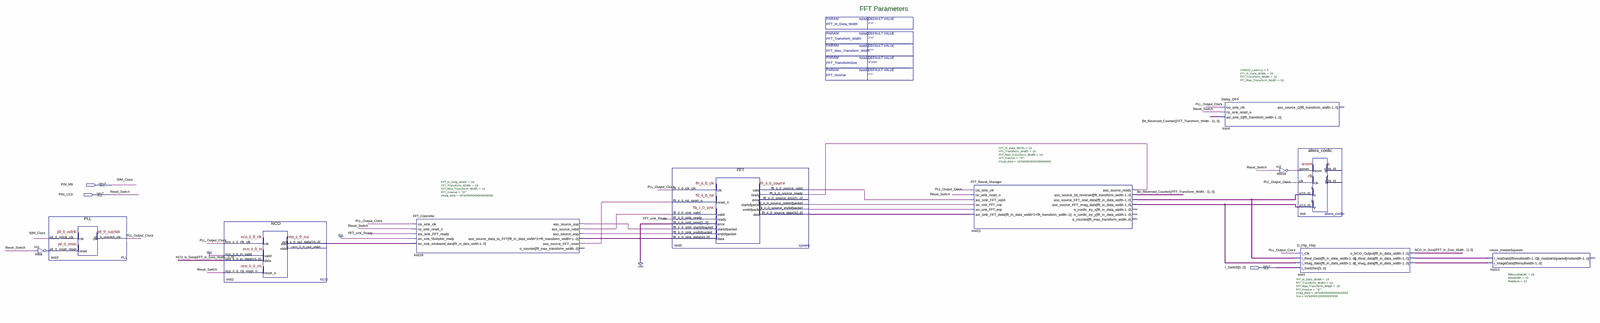
[diagram p0: schematic sheet, whole]
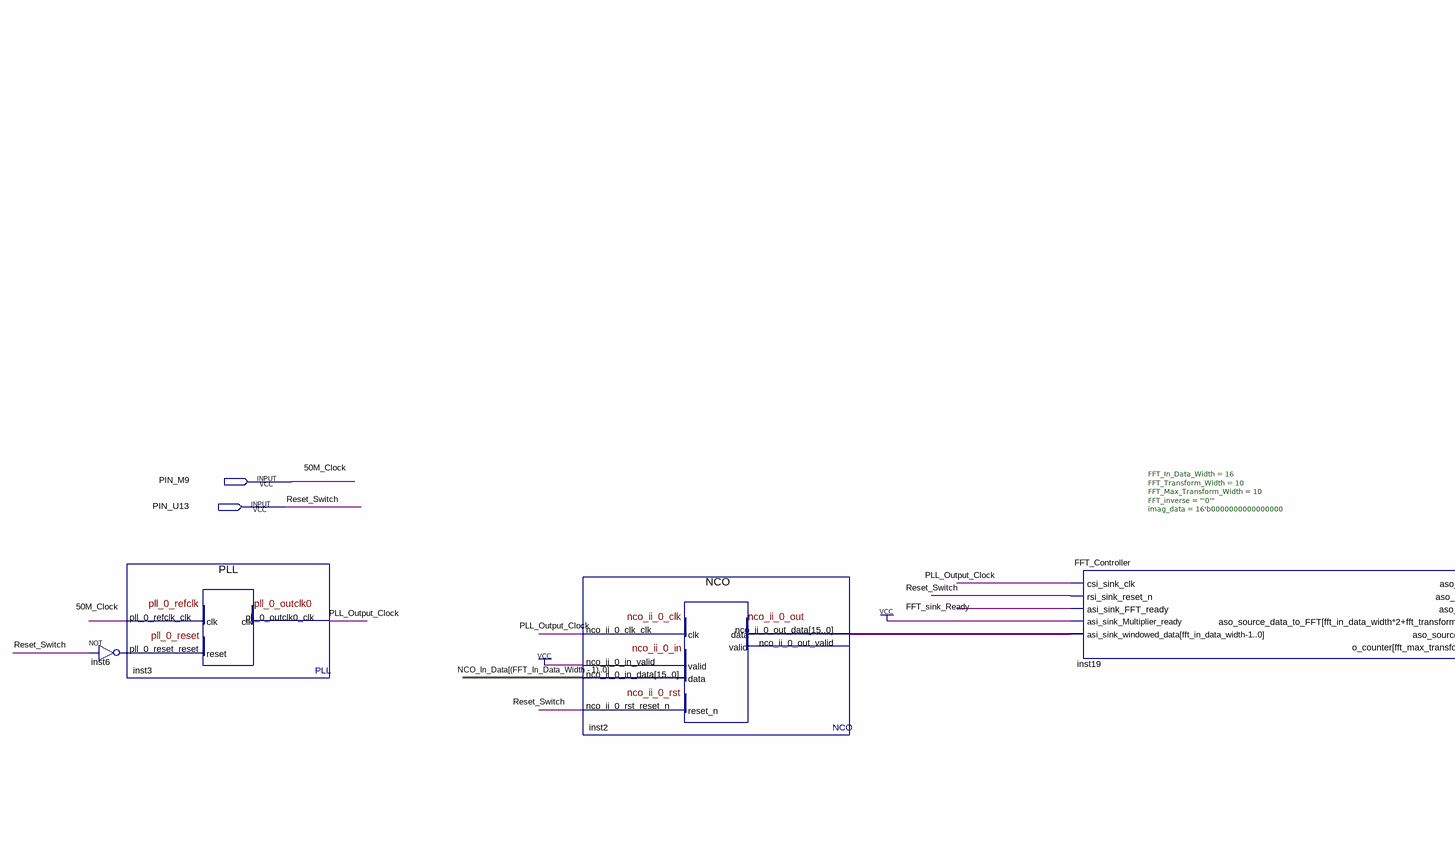
[diagram p1: schematic sheet, left part]
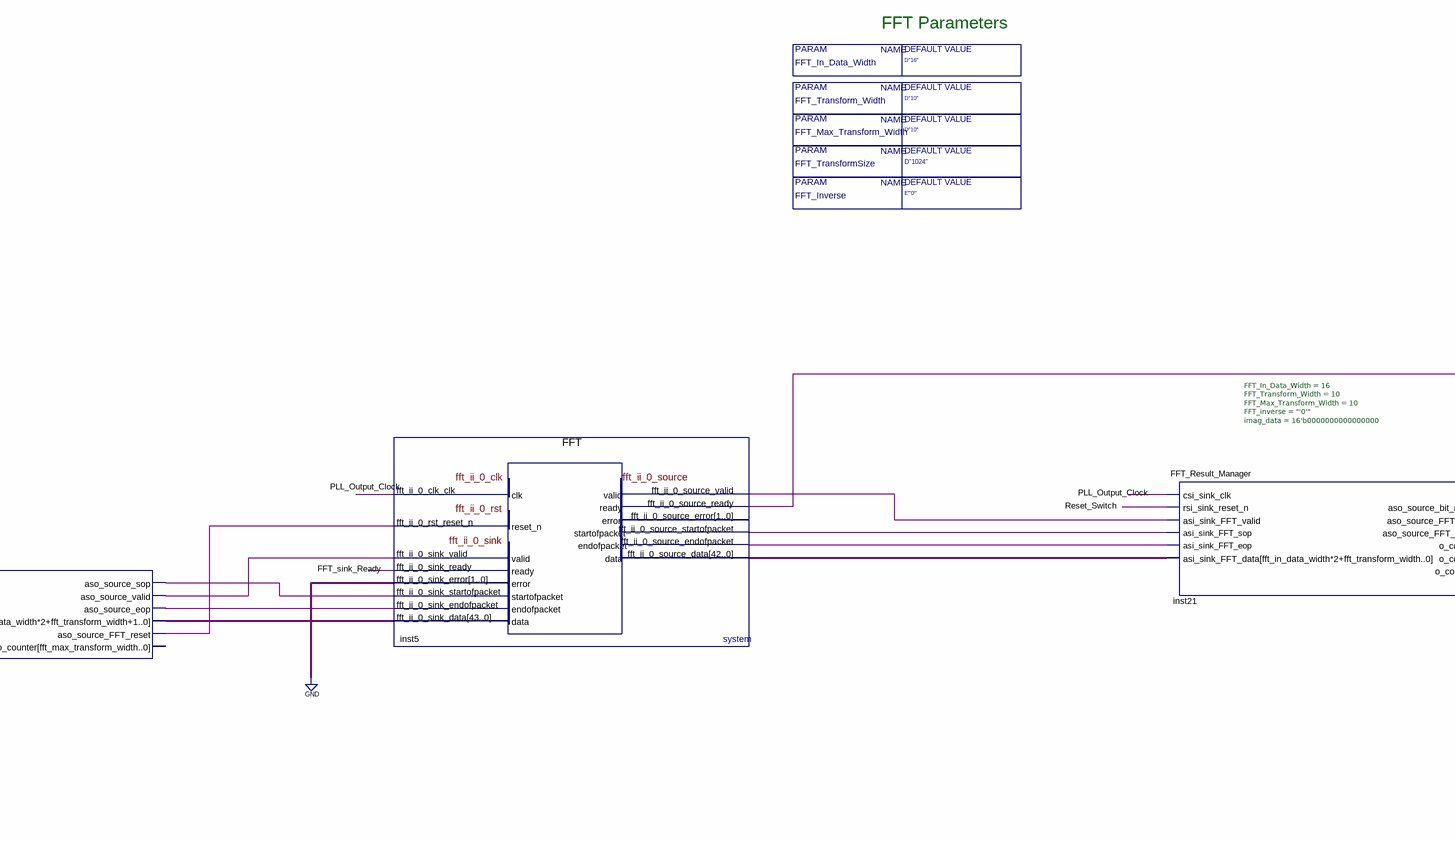
[diagram p2: schematic sheet, centre part]
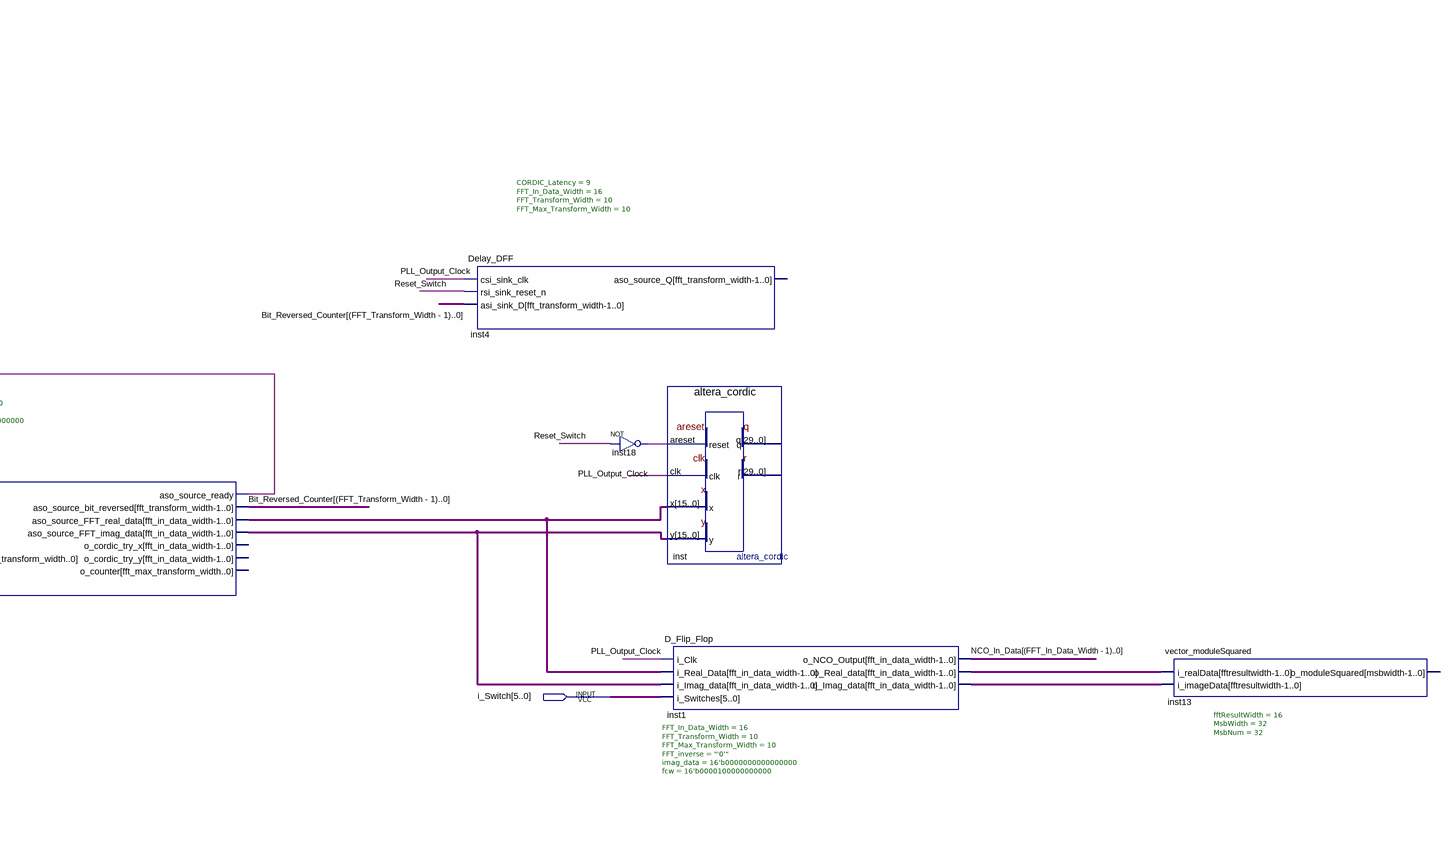
[diagram p3: schematic sheet, right part]
// Quartus schematic Top_Level_BDF.bdf as structural Verilog: 11 symbols, 3 pins
module Top_Level_BDF #(parameter FFT_Inverse = "E\"'0'\"", parameter FFT_In_Data_Width = "D\"16\"", parameter FFT_TransformSize = "D\"1024\"", parameter FFT_Transform_Width = "D\"10\"", parameter FFT_Max_Transform_Width = "D\"10\"") (
  input  PIN_M9,
  input  PIN_U13,
  input  [5:0] i_Switch
);

  wire \Bit_Reversed_Counter[(FFT_Transform_Width_-_1)..0] , FFT_sink_Ready,
       inst5_fft_ii_0_source_endofpacket, inst5_fft_ii_0_source_startofpacket, inst5_fft_ii_0_source_valid,
       inst6_out, inst18_out, inst19_aso_source_eop, inst19_aso_source_fft_reset, inst19_aso_source_sop,
       inst19_aso_source_valid, inst21_aso_source_ready, \NCO_In_Data[(FFT_In_Data_Width_-_1)..0] ,
       PLL_Output_Clock;
  wire [15:0] inst1_o_imag_data, inst1_o_real_data, inst2_nco_ii_0_out_data, inst21_aso_source_fft_imag_data,
       inst21_aso_source_fft_real_data;
  wire [42:0] inst5_fft_ii_0_source_data;
  wire [43:0] inst19_aso_source_data_to_fft;

  not inst6 (inst6_out, PIN_U13);
  PLL inst3 (.pll_0_refclk_clk(PIN_M9), .pll_0_reset_reset(inst6_out), .pll_0_outclk0_clk(PLL_Output_Clock));
  NCO inst2 (
    .nco_ii_0_clk_clk(PLL_Output_Clock), .nco_ii_0_in_valid(1'b1),
    .nco_ii_0_in_data({16{\NCO_In_Data[(FFT_In_Data_Width_-_1)..0] }}), .nco_ii_0_rst_reset_n(PIN_U13),
    .nco_ii_0_out_data(inst2_nco_ii_0_out_data));  // open: nco_ii_0_out_valid
  FFT_Controller #(.FFT_In_Data_Width(16), .FFT_Transform_Width(10), .FFT_Max_Transform_Width(10), .FFT_inverse("'0'"), .imag_data(16'b0000000000000000)) inst19 (
    .csi_sink_clk(PLL_Output_Clock), .rsi_sink_reset_n(PIN_U13), .asi_sink_FFT_ready(FFT_sink_Ready),
    .asi_sink_Multiplier_ready(1'b1), .asi_sink_windowed_data(inst2_nco_ii_0_out_data),
    .aso_source_sop(inst19_aso_source_sop), .aso_source_valid(inst19_aso_source_valid),
    .aso_source_eop(inst19_aso_source_eop), .aso_source_data_to_FFT(inst19_aso_source_data_to_fft),
    .aso_source_FFT_reset(inst19_aso_source_fft_reset));  // open: o_counter
  FFT inst5 (
    .fft_ii_0_clk_clk(PLL_Output_Clock), .fft_ii_0_rst_reset_n(inst19_aso_source_fft_reset),
    .fft_ii_0_sink_valid(inst19_aso_source_valid), .fft_ii_0_sink_error(2'b00),
    .fft_ii_0_sink_startofpacket(inst19_aso_source_sop), .fft_ii_0_sink_endofpacket(inst19_aso_source_eop),
    .fft_ii_0_sink_data(inst19_aso_source_data_to_fft), .fft_ii_0_source_ready(inst21_aso_source_ready),
    .fft_ii_0_sink_ready(FFT_sink_Ready), .fft_ii_0_source_valid(inst5_fft_ii_0_source_valid),
    .fft_ii_0_source_startofpacket(inst5_fft_ii_0_source_startofpacket),
    .fft_ii_0_source_endofpacket(inst5_fft_ii_0_source_endofpacket),
    .fft_ii_0_source_data(inst5_fft_ii_0_source_data));  // open: fft_ii_0_source_error
  FFT_Result_Manager #(.FFT_In_Data_Width(16), .FFT_Transform_Width(10), .FFT_Max_Transform_Width(10), .FFT_inverse("'0'"), .imag_data(16'b0000000000000000)) inst21 (
    .csi_sink_clk(PLL_Output_Clock), .rsi_sink_reset_n(PIN_U13),
    .asi_sink_FFT_valid(inst5_fft_ii_0_source_valid), .asi_sink_FFT_sop(inst5_fft_ii_0_source_startofpacket),
    .asi_sink_FFT_eop(inst5_fft_ii_0_source_endofpacket), .asi_sink_FFT_data(inst5_fft_ii_0_source_data),
    .aso_source_ready(inst21_aso_source_ready),
    .aso_source_bit_reversed(\Bit_Reversed_Counter[(FFT_Transform_Width_-_1)..0] ),
    .aso_source_FFT_real_data(inst21_aso_source_fft_real_data),
    .aso_source_FFT_imag_data(inst21_aso_source_fft_imag_data));  // open: o_cordic_try_x, o_cordic_try_y, o_counter
  Delay_DFF #(.CORDIC_Latency(9), .FFT_In_Data_Width(16), .FFT_Transform_Width(10), .FFT_Max_Transform_Width(10)) inst4 (
    .csi_sink_clk(PLL_Output_Clock), .rsi_sink_reset_n(PIN_U13),
    .asi_sink_D({10{\Bit_Reversed_Counter[(FFT_Transform_Width_-_1)..0] }}));  // open: aso_source_Q
  not inst18 (inst18_out, PIN_U13);
  altera_cordic inst (
    .areset(inst18_out), .clk(PLL_Output_Clock), .x(inst21_aso_source_fft_real_data),
    .y(inst21_aso_source_fft_imag_data));  // open: q, r
  D_Flip_Flop #(.FFT_In_Data_Width(16), .FFT_Transform_Width(10), .FFT_Max_Transform_Width(10), .FFT_inverse("'0'"), .imag_data(16'b0000000000000000), .fcw(16'b0000100000000000)) inst1 (
    .i_Clk(PLL_Output_Clock), .i_Real_Data(inst21_aso_source_fft_real_data),
    .i_Imag_data(inst21_aso_source_fft_imag_data), .i_Switches(i_Switch),
    .o_NCO_Output(\NCO_In_Data[(FFT_In_Data_Width_-_1)..0] ), .o_Real_data(inst1_o_real_data),
    .o_Imag_data(inst1_o_imag_data));
  vector_moduleSquared #(.fftResultWidth(16), .MsbWidth(32), .MsbNum(32)) inst13 (
    .i_realData(inst1_o_real_data), .i_imageData(inst1_o_imag_data));  // open: o_moduleSquared

  // Other names for the same wires on the sheet: 50M_Clock = PIN_M9; Reset_Switch = PIN_U13

  // Notes on the sheet:
  //   FFT Parameters
endmodule
